# EAGLE design RPi_Extension_breakout_jetson (EAGLE 7.6.0)
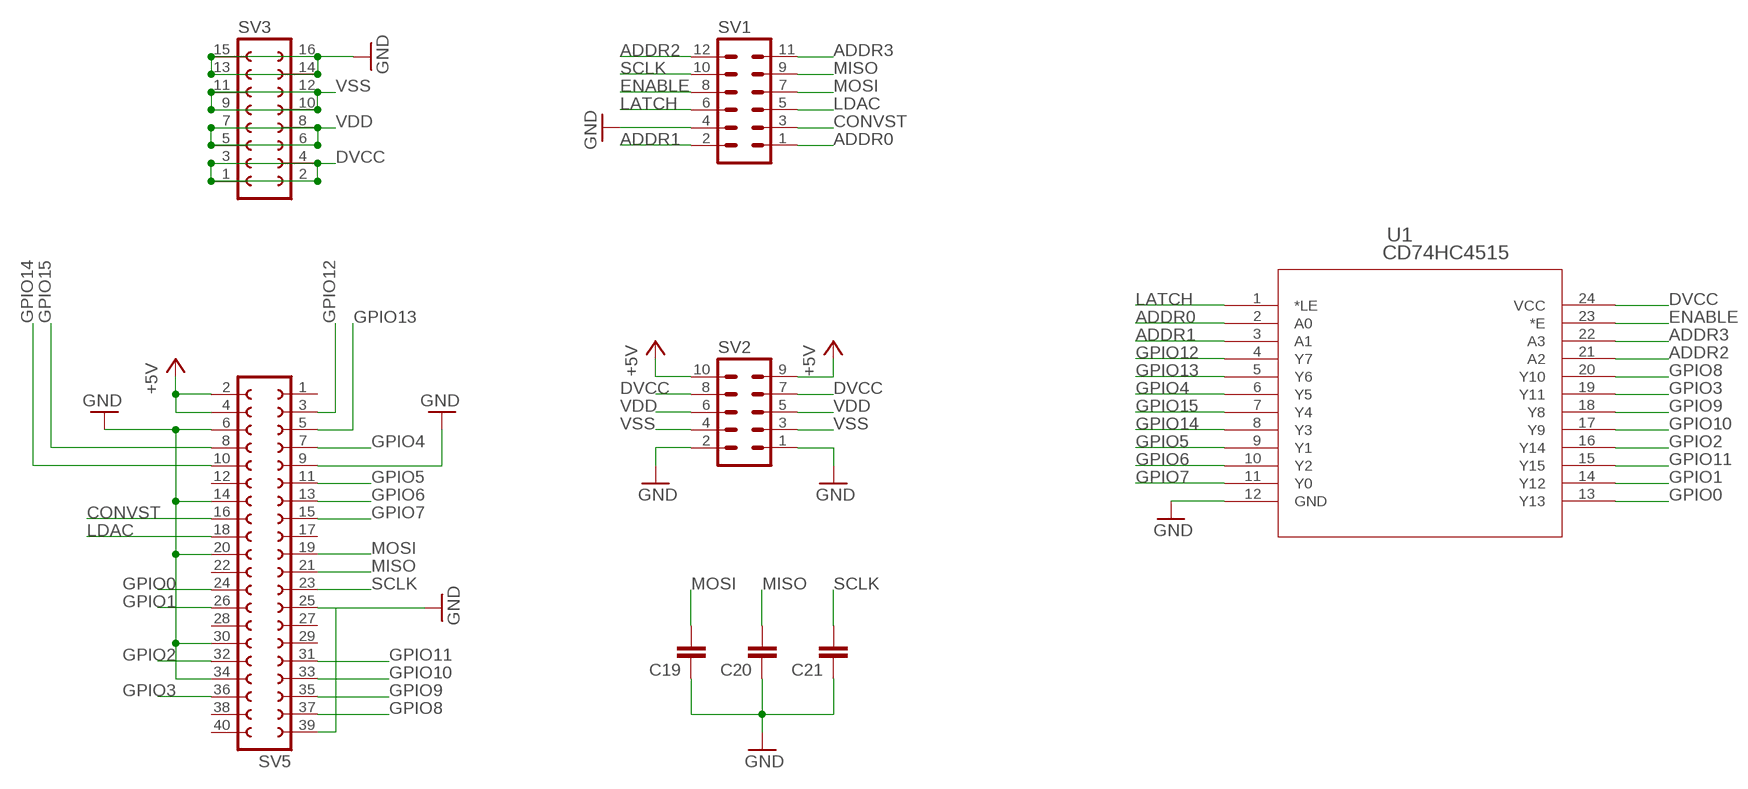
[diagram p0: schematic, sheet 1]

## Parts
C19  C-EUC0603  [C0603]
C20  C-EUC0603  [C0603]
C21  C-EUC0603  [C0603]
SV1  MA06-2  [MA06-2]
SV2  MA05-2  [MA05-2]
SV3  FE08-2  [FE08-2]
SV5  FE20-2  [FE20-2]
U1  CD74HC4515  CD74HC4515_DW_24  [DW24]

## Nets
+5V: SV2.9 SV2.10 SV5.2 SV5.4
ADDR0: SV1.1 U1.2(A0)
ADDR1: SV1.2 U1.3(A1)
ADDR2: SV1.12 U1.21(A2)
ADDR3: SV1.11 U1.22(A3)
CONVST: SV1.3 SV5.16
DVCC: SV2.7 SV2.8 SV3.1 SV3.2 SV3.3 SV3.4 U1.24(VCC)
ENABLE: SV1.8 U1.23(*E)
GND: C19.1 C20.1 C21.1 SV1.4 SV2.1 SV2.2 SV3.13 SV3.14 SV3.15 SV3.16 SV5.6 SV5.9 SV5.14 SV5.20 SV5.25 SV5.30 SV5.34 SV5.39 U1.12(GND)
GPIO0: SV5.24 U1.13(Y13)
GPIO1: SV5.26 U1.14(Y12)
GPIO2: SV5.32 U1.16(Y14)
GPIO3: SV5.36 U1.19(Y11)
GPIO4: SV5.7 U1.6(Y5)
GPIO5: SV5.11 U1.9(Y1)
GPIO6: SV5.13 U1.10(Y2)
GPIO7: SV5.15 U1.11(Y0)
GPIO8: SV5.37 U1.20(Y10)
GPIO9: SV5.35 U1.18(Y8)
GPIO10: SV5.33 U1.17(Y9)
GPIO11: SV5.31 U1.15(Y15)
GPIO12: SV5.3 U1.4(Y7)
GPIO13: SV5.5 U1.5(Y6)
GPIO14: SV5.10 U1.8(Y3)
GPIO15: SV5.8 U1.7(Y4)
LATCH: SV1.6 U1.1(*LE)
LDAC: SV1.5 SV5.18
MISO: C20.2 SV1.9 SV5.21
MOSI: C19.2 SV1.7 SV5.19
SCLK: C21.2 SV1.10 SV5.23
VDD: SV2.5 SV2.6 SV3.5 SV3.6 SV3.7 SV3.8
VSS: SV2.3 SV2.4 SV3.9 SV3.10 SV3.11 SV3.12
Unconnected: SV5.1 SV5.12 SV5.17 SV5.22 SV5.27 SV5.28 SV5.29 SV5.38 SV5.40

## Library data of the parts
C19-C21 = rcl:C-EU: CAPACITOR, European symbol
SV1 = con-lstb:MA06-2: PIN HEADER; OC_FARNELL: unknown; OC_NEWARK: unknown
SV2 = con-lstb:MA05-2: PIN HEADER; OC_FARNELL: unknown; OC_NEWARK: unknown
SV3 = con-lsta:FE08-2: FEMALE HEADER; OC_FARNELL: unknown; OC_NEWARK: unknown
SV5 = con-lsta:FE20-2: FEMALE HEADER; OC_FARNELL: unknown; OC_NEWARK: unknown
U1 = CD74HC4515:CD74HC4515_DW_24; DATASHEETURL: http://www.ti.com/lit/gpn/CD74HC4515; DESCRIPTION: High Speed CMOS Logic 4-to-16 Line Decoder/Demultiplexer with Input Latches; FAMILY_NAME: DECODER/DEMULTIPLEXER; GENERIC_PART_NUMBER: CD74HC4515; INDUSTRY_STD_PKG_TYPE: SOIC; MANUFACTURER: Texas Instruments; PACKAGE_DESIGNATOR: DW; PIN_COUNT: 24

## Board
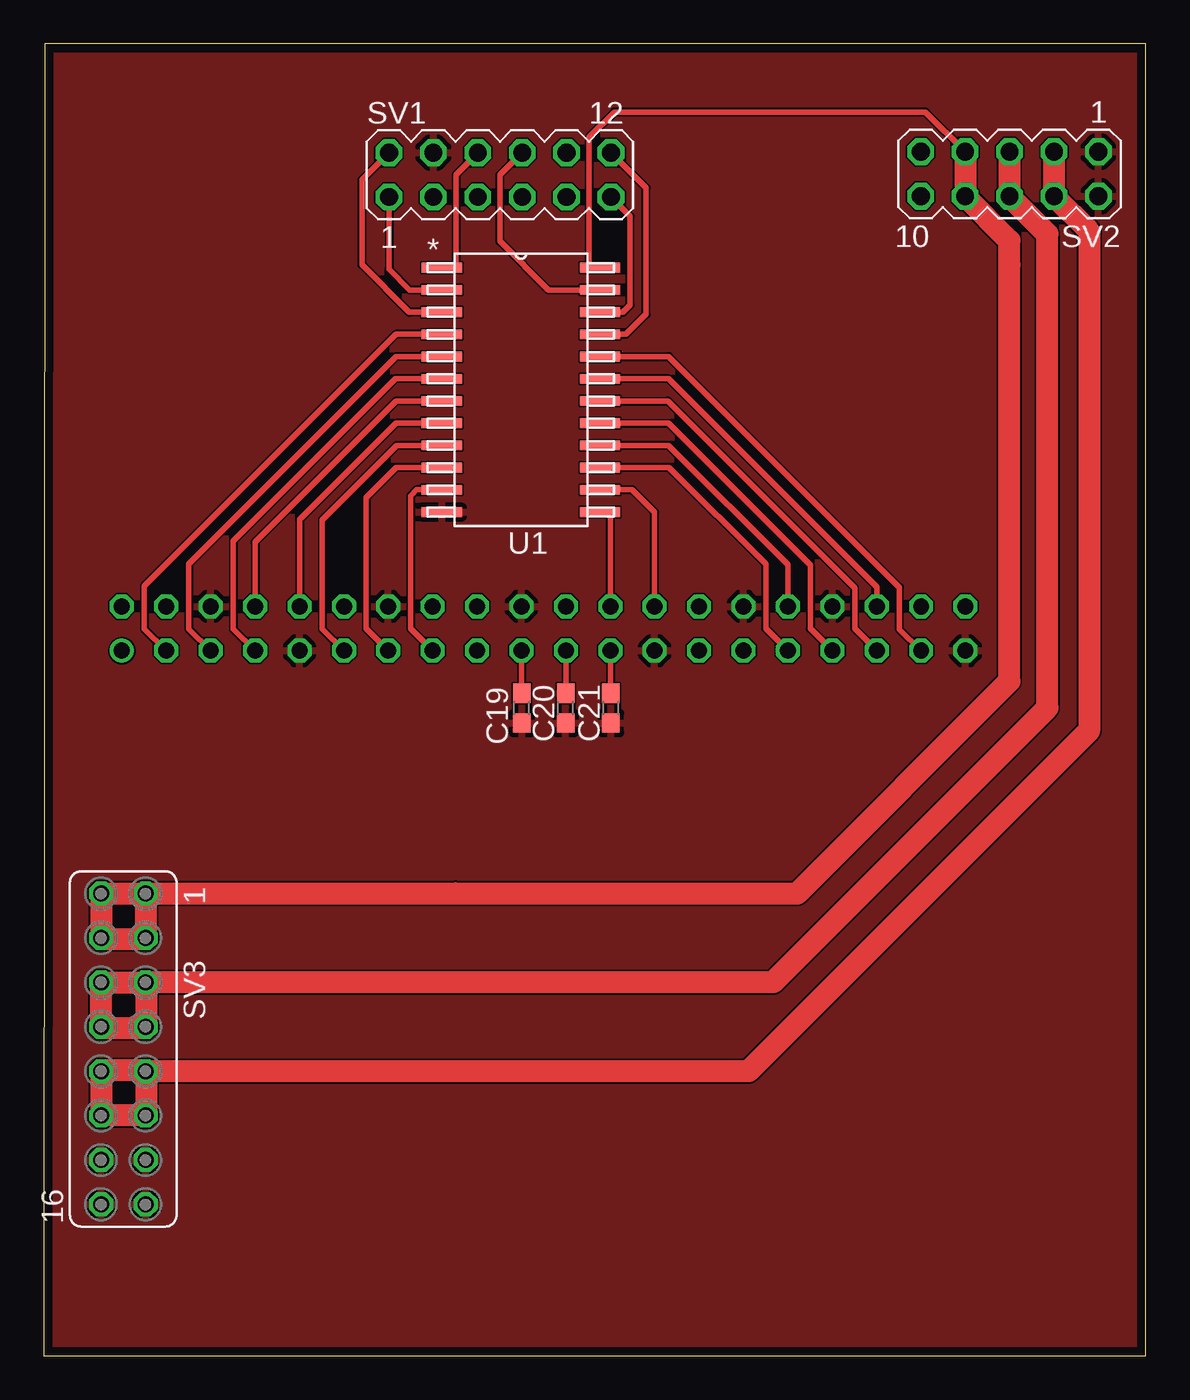
[diagram p1: board, top side]
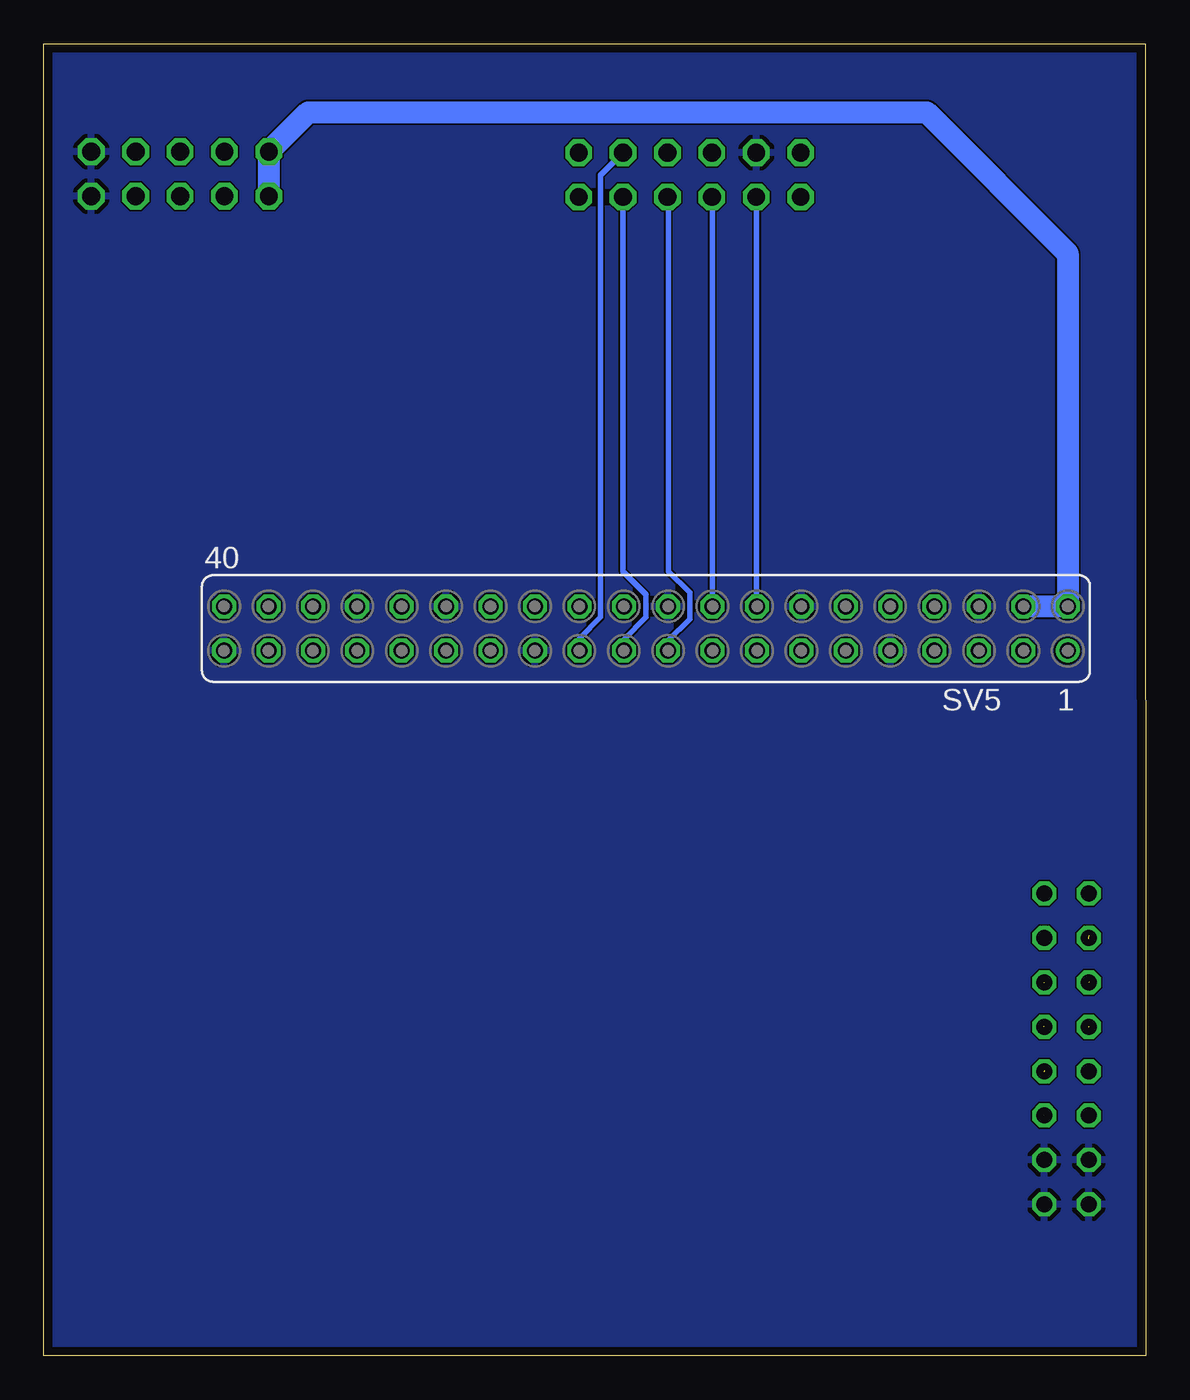
[diagram p2: board, bottom side, seen from below]

Size 63.05 x 75.05 mm. Coordinates in mm from the lower left corner, seen from the top.
Outline: 0,0 63.05,0 63.05,75.05 0.05,75.05 0,0
Copper layers (1*16): Top 0.035mm / dielectric 1.53mm / Bottom 0.035mm
Design rules "pban_4mil-l2": minimum track width 0.1mm, minimum drill 0.3mm, track to track 0.1mm, track to pad 0.229mm, pad to pad 0.1mm, via to via 0.1mm, smd to smd 0.1mm, copper to edge 0.5mm, drill to drill 0.5mm, minimum pad ring 0.15mm, minimum via ring 0.15mm, stop-mask expansion 4mil, vias tented up to drill 0.35mm, thermal gap 10mil

### Footprints (pad centres in the part's own frame; a part is rotated, then mirrored left to right if it is on the bottom)
C0603 = smd 1.1 x 1: 1 -0.85,0; 2 0.85,0
MA06-2 = drill 1.016 octagon: 1 -6.35,-1.27; 2 -6.35,1.27; 3 -3.81,-1.27; 4 -3.81,1.27; 5 -1.27,-1.27; 6 -1.27,1.27; 7 1.27,-1.27; 8 1.27,1.27; 9 3.81,-1.27; 10 3.81,1.27; 11 6.35,-1.27; 12 6.35,1.27
MA05-2 = drill 1.016 octagon: 1 -5.08,-1.27; 2 -5.08,1.27; 3 -2.54,-1.27; 4 -2.54,1.27; 5 0,-1.27; 6 0,1.27; 7 2.54,-1.27; 8 2.54,1.27; 9 5.08,-1.27; 10 5.08,1.27
FE08-2 = drill 0.914 octagon: 1 -8.89,1.27; 2 -8.89,-1.27; 3 -6.35,1.27; 4 -6.35,-1.27; 5 -3.81,1.27; 6 -3.81,-1.27; 7 -1.27,1.27; 8 -1.27,-1.27; 9 1.27,1.27; 10 1.27,-1.27; 11 3.81,1.27; 12 3.81,-1.27; 13 6.35,1.27; 14 6.35,-1.27; 15 8.89,1.27; 16 8.89,-1.27
FE20-2 = drill 0.914: 1 -24.13,1.27 | drill 0.914 octagon: 2 -24.13,-1.27; 3 -21.59,1.27; 4 -21.59,-1.27; 5 -19.05,1.27; 6 -19.05,-1.27; 7 -16.51,1.27; 8 -16.51,-1.27; 9 -13.97,1.27; 10 -13.97,-1.27; 11 -11.43,1.27; 12 -11.43,-1.27; 13 -8.89,1.27; 14 -8.89,-1.27; 15 -6.35,1.27; 16 -6.35,-1.27; 17 -3.81,1.27; 18 -3.81,-1.27; 19 -1.27,1.27; 20 -1.27,-1.27; 21 1.27,1.27; 22 1.27,-1.27; 23 3.81,1.27; 24 3.81,-1.27; 25 6.35,1.27; 26 6.35,-1.27; 27 8.89,1.27; 28 8.89,-1.27; 29 11.43,1.27; 30 11.43,-1.27; 31 13.97,1.27; 32 13.97,-1.27; 33 16.51,1.27; 34 16.51,-1.27; 35 19.05,1.27; 36 19.05,-1.27; 37 21.59,1.27; 38 21.59,-1.27; 39 24.13,1.27; 40 24.13,-1.27
DW24 = smd 2.311 x 0.559: 1 -4.521,6.985; 2 -4.521,5.715; 3 -4.521,4.445; 4 -4.521,3.175; 5 -4.521,1.905; 6 -4.521,0.635; 7 -4.521,-0.635; 8 -4.521,-1.905; 9 -4.521,-3.175; 10 -4.521,-4.445; 11 -4.521,-5.715; 12 -4.521,-6.985; 13 4.521,-6.985; 14 4.521,-5.715; 15 4.521,-4.445; 16 4.521,-3.175; 17 4.521,-1.905; 18 4.521,-0.635; 19 4.521,0.635; 20 4.521,1.905; 21 4.521,3.175; 22 4.521,4.445; 23 4.521,5.715; 24 4.521,6.985

### Placement (x,y rotation side)
C19  27.35,37.05 90 top
C20  29.85,37.05 90 top
C21  32.45,37.05 90 top
SV1  26.1,67.55 0 top
SV2  55.25,67.6 180 top
SV3  4.55,17.55 270 top
SV5  28.6,41.6 180 bottom
U1  27.3,55.25 0 top

### Tracks (layer width: path | path; a pad name or v marks a point on that pad's centre or on a via)
+5V
  Bottom 1.27: SV2.10 SV2.9 47.92,71.12 12.54,71.12 4.47,63.05 SV5.2 SV5.4
ADDR0
  Top 0.305: SV1.1 19.75,62.15 20.93,60.97 U1.2
ADDR1
  Top 0.305: SV1.2 18.2,67.27 18.2,62.4 20.91,59.7 U1.3
ADDR2
  Top 0.305: SV1.12 34.46,66.81 34.46,59.58 33.31,58.42 U1.21
ADDR3
  Top 0.305: U1.22 33.14,59.7 33.55,60.1 33.55,65.18 SV1.11
CONVST
  Bottom 0.305: SV1.3 22.29,42.91 SV5.16
DVCC  (2 unrouted)
  Top 0.305: 23.55,26.94 24.05,26.44 | 55.09,62.23 55.25,62.4 | SV2.7 50.44,71.14 32.65,71.14 31.2,69.7 31.2,62.4 31.36,62.23 U1.24
  Top 1.27: SV2.7 SV2.8 55.25,63.79 55.25,62.4 55.25,38.59 43.1,26.44 24.05,26.44 SV3.1 | SV3.1 SV3.2 SV3.4 | SV3.1 SV3.3 | 3.28,23.84 5.82,23.84
  Bottom 1.016: 3.25,24.05 3.28,24.05
ENABLE
  Top 0.305: SV1.8 26.1,67.55 26.1,63.75 28.89,60.97 U1.23
GND
  pour Top: -0.65,-0.65 63.7,-0.65 63.7,82.15 -0.65,82.15
  pour Bottom: 0,0 0.65,81 63.7,81 63.05,0
GPIO0
  Top 0.305: SV5.24 32.41,48.19 32.35,48.25 31.84,48.25 U1.13
GPIO1
  Top 0.305: U1.14 33.66,49.53 34.95,48.25 SV5.26
GPIO2
  Top 0.305: SV5.32 42.57,45.25 35.74,52.08 U1.16
GPIO3
  Top 0.305: SV5.36 47.65,43.96 35.73,55.88 U1.19
GPIO4
  Top 0.305: U1.6 20.12,55.88 10.85,46.61 10.85,41.57 SV5.7
GPIO5
  Top 0.305: U1.9 20.19,52.08 15.93,47.81 15.93,41.57 SV5.11
GPIO6
  Top 0.305: U1.10 20.16,50.8 18.45,49.09 18.45,41.59 SV5.13
GPIO7
  Top 0.305: U1.11 21.34,49.53 20.99,49.19 20.99,41.59 SV5.15
GPIO8
  Top 0.305: U1.20 35.75,57.16 48.95,43.95 48.95,41.55 50.17,40.33 SV5.37
GPIO9
  Top 0.305: U1.18 35.7,54.62 46.4,43.91 46.4,41.6 47.65,40.35 SV5.35
GPIO10
  Top 0.305: U1.17 35.73,53.34 43.85,45.23 43.85,41.59 SV5.33
GPIO11
  Top 0.305: U1.15 35.78,50.8 41.3,45.28 41.3,41.6 SV5.31
GPIO12
  Top 0.305: U1.4 20.16,58.42 5.76,44.02 5.76,41.58 SV5.3
GPIO13
  Top 0.305: U1.5 20.16,57.16 8.3,45.29 8.3,41.58 SV5.5
GPIO14
  Top 0.305: U1.8 20.15,53.34 14.63,47.83 SV5.10
GPIO15
  Top 0.305: U1.7 20.17,54.62 12.09,46.54 SV5.8
LATCH
  Top 0.305: SV1.6 24.83,68.78 23.6,67.55 23.6,62.25 23.55,62.2 22.81,62.2 U1.1
LDAC
  Bottom 0.305: SV5.18 24.79,66.24 SV1.5
MISO
  Top 0.305: SV5.21 29.87,37.92
  Top 0.406: 29.87,37.92 C20.2
  Bottom 0.305: SV5.21 29.87,40.98 28.6,42.25 28.6,43.55 29.9,44.85 SV1.9
MOSI
  Top 0.305: SV5.19 27.33,37.92
  Top 0.406: 27.33,37.92 C19.2
  Bottom 0.305: SV5.19 27.33,40.92 26.1,42.15 26.1,43.65 27.3,44.85 27.3,66.21 SV1.7
SCLK
  Top 0.305: SV5.23 32.41,37.94
  Top 0.406: 32.41,37.94 C21.2
  Bottom 0.305: SV5.23 32.41,41.04 31.2,42.25 31.2,67.53 SV1.10
VDD  (4 unrouted)
  Top 1.27: SV2.5 SV2.6 57.42,64.16 57.42,37.06 41.72,21.36 SV3.5 3.25,21.36 3.25,18.85 | 3.28,18.76 5.2,18.76 | 5.2,18.76 5.82,18.76 | 5.2,18.76 5.29,18.85 5.85,18.85 5.85,21.36
VSS  (3 unrouted)
  Top 1.27: SV3.10 SV3.12 SV3.11 | 5.85,13.75 5.85,16.28 40.31,16.28 59.8,35.77 59.8,64.32 SV2.4 SV2.3 | 5.82,16.34 3.28,16.34
  Bottom 0.406: 5.82,13.65 SV3.11
  Bottom 1.27: SV3.11